# EAGLE design iswitchpihat (EAGLE 7.7.0)
CNAME: Intelligent Power Switch for Pi; CREVISION: 5; DESIGNER: Peter K. Boxler
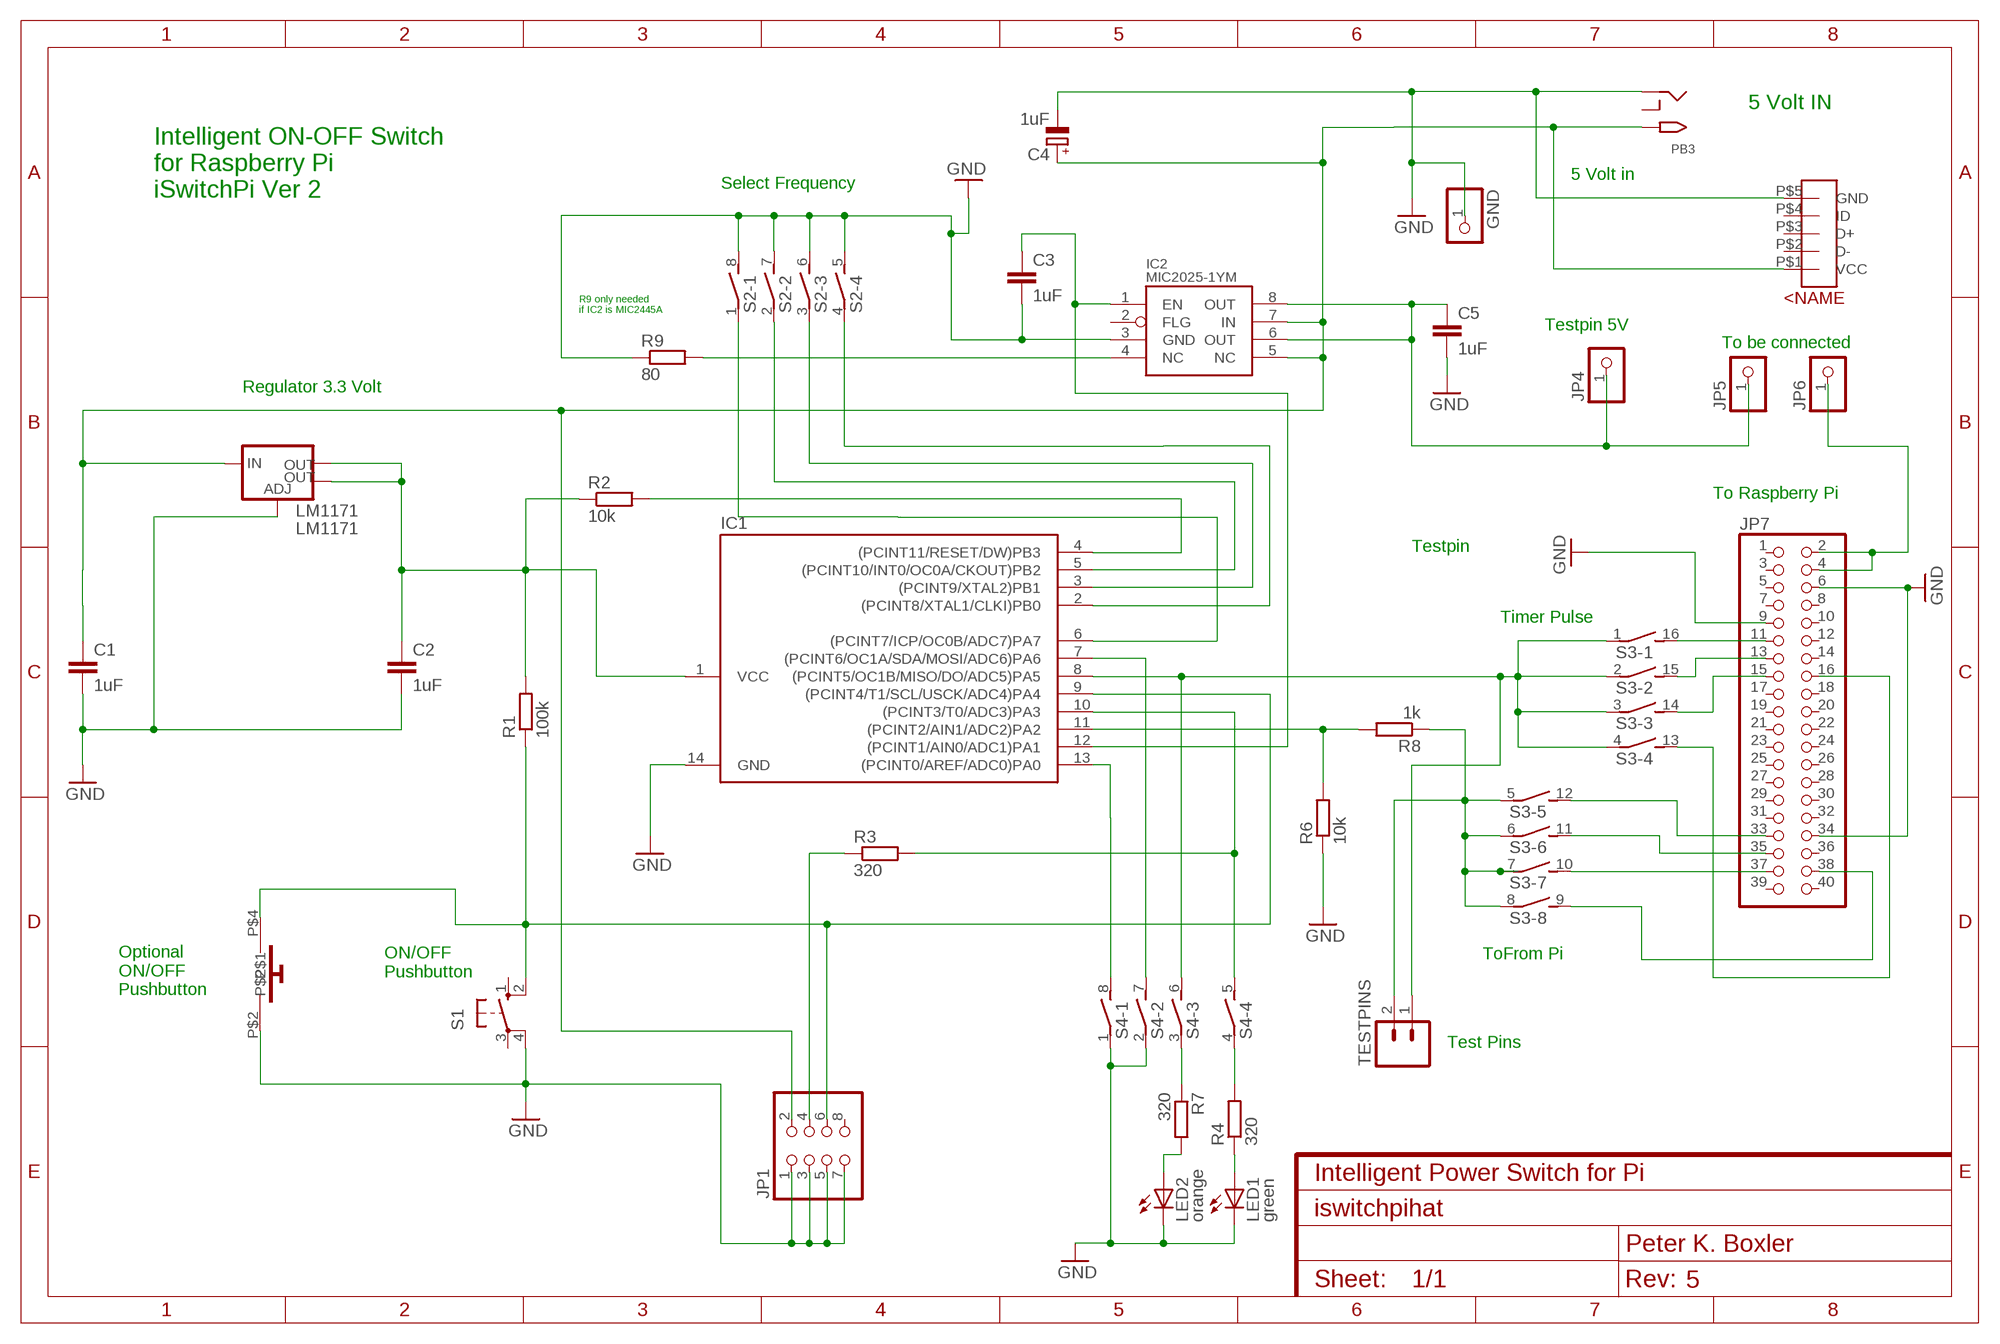
[diagram p0: schematic, sheet 1]

## Parts
C1  1uF  C-EUC1206  [C1206]
C2  1uF  C-EUC1206  [C1206]
C3  1uF  C-EUC1206  [C1206]
C4  1uF  CPOL-EUE2,5-6E  [E2,5-6E]
C5  1uF  C-EUC1206  [C1206]
GND  PINHD-1X1  [1X01]
IC1  ATTINY24/44/84-PU  [DIL14]
IC2  MIC2025-1YM  [SO08]
JP1  PINHD-2X4  [2X04]
JP4  PINHD-1X1  [1X01]
JP5  PINHD-1X1  [1X01]
JP6  PINHD-1X1  [1X01]
JP7  PINHD-2X20-BIG  [2X20-BIG]
LED1  green  LEDSMT1206  [1206]
LED2  orange  LEDSMT1206  [1206]
LM1171  LM1171  V_REG_LM1117SOT223  [SOT223]
PB1  PB6A-ELEDIS  [PA52]
PB3  2.1MMJACK  [ISWITCHPI_PJ-SMALLHOLES]
PB4  USBMICRO  ADAUSBMICRO  [ADAUSBMICRO]
R1  100k  R-EU_0204/7  [0204/7]
R2  10k  R-EU_0204/7  [0204/7]
R3  320  R-EU_0204/7  [0204/7]
R4  320  R-EU_0204/7  [0204/7]
R6  10k  R-EU_0204/7  [0204/7]
R7  320  R-EU_0204/7  [0204/7]
R8  1k  R-EU_0204/7  [0204/7]
R9  80  R-EU_0204/7  [0204/7]
S1  10-XX  [B3F-10XX]
S2  DIP04S  [DIP04S]
S3  DIP08S  [DIP08S]
S4  DIP04S  [DIP04S]
TESTPINS  M02PTH  [1X02]

## Nets
3.3V: C2.1 IC1.1(VCC) LM1171.2(OUT) LM1171.4(OUT) R1.2 R2.1
5VIN [5Volt]: C1.1 C4.+ IC2.5(NC) IC2.7(IN) JP1.2 LM1171.3(IN) PB3.TIP PB4.P$1(VCC)
5VOUT [5Volt]: C5.1 IC2.6(OUT) IC2.8(OUT) JP4.1 JP5.1
GND: C1.2 C2.2 C3.2 C4.- C5.2 GND.1 IC1.14(GND) IC2.3(GND) JP1.1 JP1.3 JP1.5 JP1.7 JP7.6 JP7.9 JP7.34 LED1.C LED2.C LM1171.1(ADJ) PB1.P$2 PB3.RING PB4.P$5(GND) R6.1 R9.1 S1.4(P1) S2.5 S2.6 S2.7 S2.8 S4.1 S4.2
N$1: IC1.9((PCINT4/T1/SCL/USCK/ADC4)PA4) JP1.6 PB1.P$4 R1.1 S1.2(S1)
N$2: IC1.6((PCINT7/ICP/OC0B/ADC7)PA7) S2.1
N$3: JP7.11 S3.16
N$4: IC1.4((PCINT11/RESET/DW)PB3) R2.2
N$6: C3.1 IC1.12((PCINT1/AIN0/ADC1)PA1) IC2.1(EN)
N$7: IC1.11((PCINT2/AIN1/ADC2)PA2) R6.2 R8.2
N$8: R8.1 S3.5 S3.6 S3.7 S3.8 TESTPINS.2
N$9: IC1.10((PCINT3/T0/ADC3)PA3) R3.2 S4.5
N$10: JP7.13 S3.15
N$11: R7.1 S4.3
N$12: LED1.A R4.1
N$13: JP1.4 R3.1
N$14: LED2.A R7.2
N$15: JP7.15 S3.14
N$16: JP7.16 S3.13
N$17: R4.2 S4.4
N$18: IC1.2((PCINT8/XTAL1/CLKI)PB0) S2.4
N$19: JP7.38 S3.9
N$20: IC1.5((PCINT10/INT0/OC0A/CKOUT)PB2) S2.2
N$21: IC1.3((PCINT9/XTAL2)PB1) S2.3
N$22 [5Volt]: JP6.1 JP7.2 JP7.4
N$23: JP7.37 S3.10
N$24: JP7.35 S3.11
N$25: JP7.33 S3.12
N$26: IC1.7((PCINT6/OC1A/SDA/MOSI/ADC6)PA6) S4.7
N$27: IC1.13((PCINT0/AREF/ADC0)PA0) S4.8
N$28: IC1.8((PCINT5/OC1B/MISO/DO/ADC5)PA5) S3.1 S3.2 S3.3 S3.4 S4.6 TESTPINS.1
N$29: IC2.4(NC) R9.2
Unconnected: IC2.2(FLG) JP1.8 JP7.1 JP7.3 JP7.5 JP7.7 JP7.8 JP7.10 JP7.12 JP7.14 JP7.17 JP7.18 JP7.19 JP7.20 JP7.21 JP7.22 JP7.23 JP7.24 JP7.25 JP7.26 JP7.27 JP7.28 JP7.29 JP7.30 JP7.31 JP7.32 JP7.36 JP7.39 JP7.40 PB3.RING_SW PB4.P$2(D-) PB4.P$3(D+) PB4.P$4(ID) S1.1(S) S1.3(P)

## Notes on the sheet
- 5 Volt IN
- 5 Volt in
- Select Frequency
- Intelligent ON-OFF Switch
  for Raspberry Pi
  iSwitchPi Ver 2
- R9 only needed 
  if IC2 is MIC2445A
- Testpin 5V
- To be connected
- Regulator 3.3 Volt
- To Raspberry Pi
- Testpin
- Timer Pulse
- ToFrom Pi
- ON/OFF 
  Pushbutton
- Optional
  ON/OFF 
  Pushbutton
- Test Pins

## Library data of the parts
C1-C3 C5 = rcl:C-EU: CAPACITOR, European symbol
C4 = resistor:CPOL-EU: POLARIZED CAPACITOR, European symbol
GND JP4-JP6 = adafruit:PINHD-1X1: Pin header 1x1 for 0.1" spacing With round pins
IC1 = attiny24_44_84:ATTINY24/44/84
IC2 = micrel:MIC2025-1Y: Single-Channel Power Distribution Switch
JP1 = adafruit:PINHD-2X4: PIN HEADER
JP7 = adafruit:PINHD-2X20: PIN HEADER
LED1 LED2 = led:LED: LED OSRAM: - CHIPLED LG R971, LG N971, LY N971, LG Q971, LY Q971, LO R971, LY R971 LH N974, LH R974 LS Q976, LO Q976, LY Q976 LO Q996 - Hyper CHIPLED LW Q18S LB Q993, LB Q99A, LB R99A - SideLED LS A670, LO A670, LY A670, LG A670, LP A670 LB A673, LV A673, LT A673, LW A673 LH A674 LY A675 LS A676, LA A676, LO A676, LY A676, LW A676 LS A679, LY A679, LG A679 - Hyper Micro SIDELED® LS Y876, LA Y876, LO Y876, LY Y876 LT Y87S - SmartLED LW L88C, LW L88S LB L89C, LB L89S, LG L890 LS L89K, LO L89K, LY L89K LS L896, LA L896, LO L896, LY L896 - TOPLED LS T670, LO T670, LY T670, LG T670, LP T670 LSG T670, LSP T670, LSY T670, LOP T670, LYG T670 LG T671, LOG T671, LSG T671 LB T673, LV T673, LT T673, LW T673 LH T674 LS T676, LA T676, LO T676, LY T676, LB T676, LH T676, LSB T676, LW T676 LB T67C, LV T67C, LT T67C, LS T67K, LO T67K, LY T67K, LW E67C LS E67B, LA E67B, LO E67B, LY E67B, LB E67C, LV E67C, LT E67C LW T67C LS T679, LY T679, LG T679 LS T770, LO T770, LY T770, LG T770, LP T770 LB T773, LV T773, LT T773, LW T773 LH T774 LS E675, LA E675, LY E675, LS T675 LS T776, LA T776, LO T776, LY T776, LB T776 LHGB T686 LT T68C, LB T68C - Hyper Mini TOPLED® LB M676 - Mini TOPLED Santana® LG M470 LS M47K, LO M47K, LY M47K Source: http://www.osram.convergy.de LUXEON: - LUMILED® LXK2-PW12-R00, LXK2-PW12-S00, LXK2-PW14-U00, LXK2-PW14-V00 LXK2-PM12-R00, LXK2-PM12-S00, LXK2-PM14-U00 LXK2-PE12-Q00, LXK2-PE12-R00, LXK2-PE12-S00, LXK2-PE14-T00, LXK2-PE14-U00 LXK2-PB12-K00, LXK2-PB12-L00, LXK2-PB12-M00, LXK2-PB14-N00, LXK2-PB14-P00, LXK2-PB14-Q00 LXK2-PR12-L00, LXK2-PR12-M00, LXK2-PR14-Q00, LXK2-PR14-R00 LXK2-PD12-Q00, LXK2-PD12-R00, LXK2-PD12-S00 LXK2-PH12-R00, LXK2-PH12-S00 LXK2-PL12-P00, LXK2-PL12-Q00, LXK2-PL12-R00 Source: www.luxeon.com KINGBRIGHT: KA-3528ASYC Source: www.kingbright.com
LM1171 = SparkFun-PowerIC:V_REG_LM1117: Voltage Regulator LM1117 Standard adjustable voltage regulator but in SMD form. Spark Fun Electronics SKU : COM-00595; PROD_ID: VREG-08170
PB1 = a-mylibrary:PB6A-ELEDIS: PushButton Eledis (Distrelec) für iswitcjPihat
PB3 = iswitchpihat:2.1MMJACK: 2.1mm x 5.5mm THM DC jack with internal switch. Digikey part #PJ-102A, 4UCON part #05537 2.1mm x 5.5mm SMT DC jack with internal switch. Digikey part #PJ-002A-SMT, 4UCON part #03267 By microbuilder.eu & adafruit.com
PB4 = a-mylibrary:ADAUSBMICRO
R1-R4 R6-R9 = resistor:R-EU_: RESISTOR, European symbol
S1 = switch-omron:10-XX: OMRON SWITCH; MPN: B3F-1000; OC_FARNELL: 176432; OC_NEWARK: 36M3542
S2 S4 = switch-dil:DIP04S: DIL/CODE SWITCH
S3 = switch-dil:DIP08S: DIL/CODE SWITCH
TESTPINS = SparkFun-Connectors:M02: Standard 2-pin 0.1" header. Use with - straight break away headers ( PRT-00116) - right angle break away headers (PRT-00553) - swiss pins (PRT-00743) - machine pins (PRT-00117) - female headers (PRT-00115) Molex polarized connector foot print use with: PRT-08233 with associated crimp pins and housings. 2.54_SCREWTERM for use with PRT-10571. 3.5mm Screw Terminal footprints for PRT-08084 5mm Screw Terminal footprints for use with PRT-08432

## Net classes
1 5Volt: width 1.016 mm

## Board
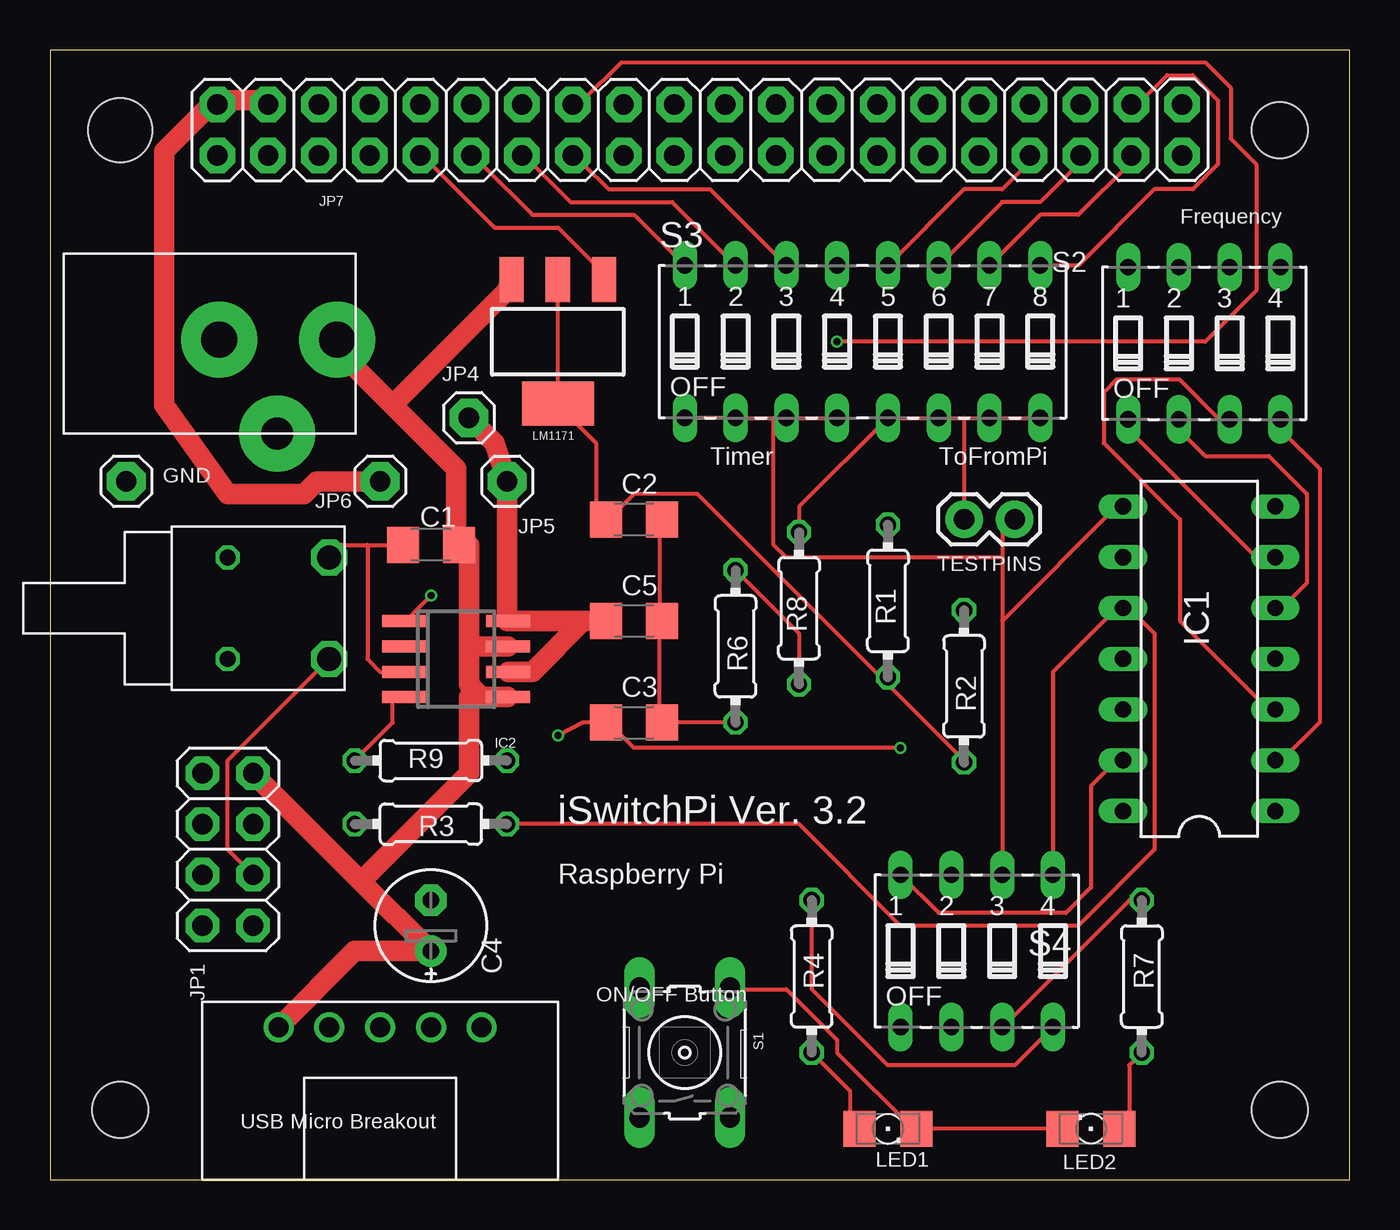
[diagram p1: board, top side]
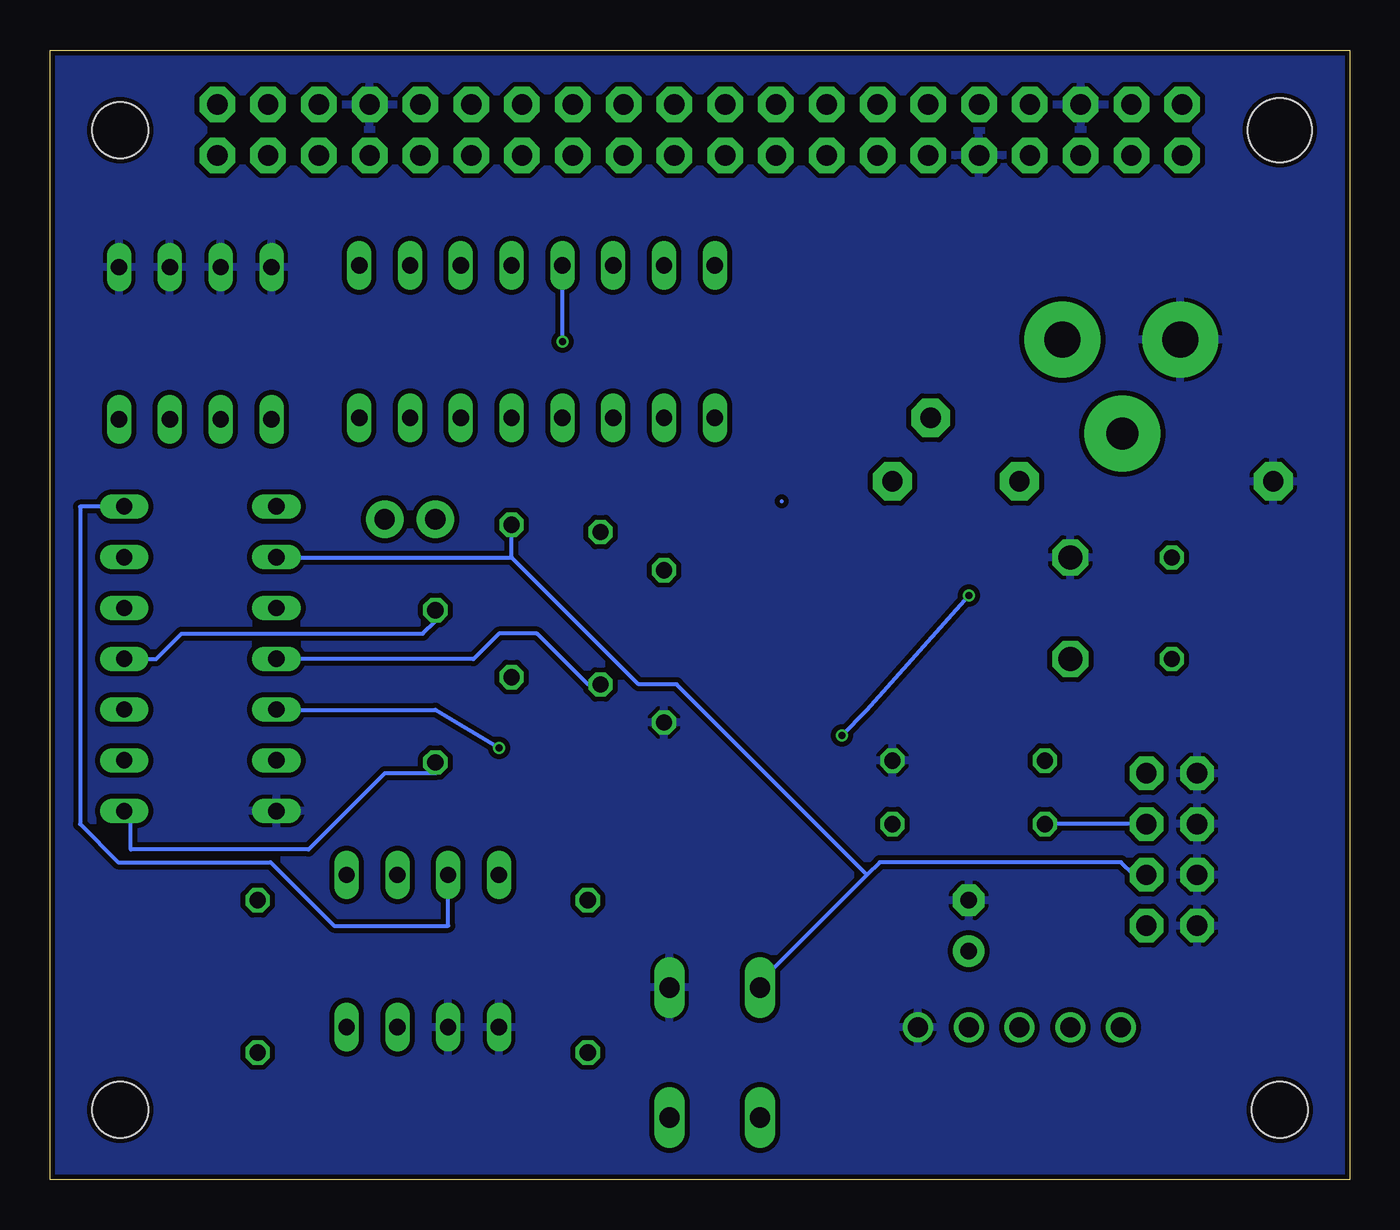
[diagram p2: board, bottom side, seen from below]

Size 65 x 56.5 mm. Coordinates in mm from the lower left corner, seen from the top.
Outline: 0,0 65,0 65,56.5 0,56.5 0,0
Copper layers (1*16): Top 0.035mm / dielectric 1.55mm / Bottom 0.035mm
Design rules "eC_2Layer_PClass6_BaseCopperO35 *": minimum track width 0.2mm, minimum drill 0.35mm, track to track 0.25mm, track to pad 0.25mm, pad to pad 0.25mm, via to via 0.25mm, smd to smd 0mil, copper to edge 0.25mm, drill to drill 0.35mm, minimum pad ring 0.175mm, minimum via ring 0.125mm, stop-mask expansion 0mil, vias tented up to drill 0.45mm, thermal gap 0.2mm
Holes 3.2 mm at 3.5,52.5
Holes 2.8 mm at 61.5,52.5 61.5,3.5 3.5,3.5

### Footprints (pad centres in the part's own frame; a part is rotated, then mirrored left to right if it is on the bottom)
C1206 = smd 1.6 x 1.8: 1 -1.4,0; 2 1.4,0
E2,5-6E = drill 0.813 pad 1.575: + -1.27,0 | drill 0.813 pad 1.575 octagon: - 1.27,0
1X01 = drill 1.016 pad 1.93 octagon: 1 0,0
DIL14 = drill 0.813 long: 1 -7.62,-3.81; 2 -5.08,-3.81; 3 -2.54,-3.81; 4 0,-3.81; 5 2.54,-3.81; 6 5.08,-3.81; 7 7.62,-3.81; 8 7.62,3.81; 9 5.08,3.81; 10 2.54,3.81; 11 0,3.81; 12 -2.54,3.81; 13 -5.08,3.81; 14 -7.62,3.81
SO08 = smd 0.6 x 2.2: 1 -1.905,-2.6; 2 -0.635,-2.6; 3 0.635,-2.6; 4 1.905,-2.6; 5 1.905,2.6; 6 0.635,2.6; 7 -0.635,2.6; 8 -1.905,2.6
2X04 = drill 1.016 pad 1.676 octagon: 1 -3.81,-1.27; 2 -3.81,1.27; 3 -1.27,-1.27; 4 -1.27,1.27; 5 1.27,-1.27; 6 1.27,1.27; 7 3.81,-1.27; 8 3.81,1.27
2X20-BIG = drill 1.016 pad 1.778 octagon: 1 -24.13,-1.27; 2 -24.13,1.27; 3 -21.59,-1.27; 4 -21.59,1.27; 5 -19.05,-1.27; 6 -19.05,1.27; 7 -16.51,-1.27; 8 -16.51,1.27; 9 -13.97,-1.27; 10 -13.97,1.27; 11 -11.43,-1.27; 12 -11.43,1.27; 13 -8.89,-1.27; 14 -8.89,1.27; 15 -6.35,-1.27; 16 -6.35,1.27; 17 -3.81,-1.27; 18 -3.81,1.27; 19 -1.27,-1.27; 20 -1.27,1.27; 21 1.27,-1.27; 22 1.27,1.27; 23 3.81,-1.27; 24 3.81,1.27; 25 6.35,-1.27; 26 6.35,1.27; 27 8.89,-1.27; 28 8.89,1.27; 29 11.43,-1.27; 30 11.43,1.27; 31 13.97,-1.27; 32 13.97,1.27; 33 16.51,-1.27; 34 16.51,1.27; 35 19.05,-1.27; 36 19.05,1.27; 37 21.59,-1.27; 38 21.59,1.27; 39 24.13,-1.27; 40 24.13,1.27
1206 = smd 1.6 x 1.803: A -1.422,0; C 1.422,0
SOT223 = smd 1.219 x 2.235: 1 -2.311,-3.099; 2 0,-3.099; 3 2.311,-3.099 | smd 3.6 x 2.2: 4 0,3.099
PA52 = drill 0.8 octagon: P$1 -2.54,1.27; P$3 -2.54,-3.81 | drill 1.2 octagon: P$2 2.54,1.27; P$4 2.54,-3.81
ISWITCHPI_PJ-SMALLHOLES = drill 1.8 pad 3.8: RING 0.1,-3.39; TIP 0.1,-9.29 | drill 1.6 pad 3.8: RING_SW -4.6,-6.29
ADAUSBMICRO = drill 1: P$1 -6.35,2.54; P$2 -3.81,2.54; P$3 -1.27,2.54; P$4 1.27,2.54; P$5 3.81,2.54
0204/7 = drill 0.813 octagon: 1 -3.81,0; 2 3.81,0
B3F-10XX = drill 1.016 long: 1 -3.251,2.261; 2 3.251,2.261; 3 -3.251,-2.261; 4 3.251,-2.261
DIP04S = drill 0.813 long: 1 -3.81,-3.81; 2 -1.27,-3.81; 3 1.27,-3.81; 4 3.81,-3.81; 5 3.81,3.81; 6 1.27,3.81; 7 -1.27,3.81; 8 -3.81,3.81
DIP08S = drill 0.813 long: 1 -8.89,-3.81; 2 -6.35,-3.81; 3 -3.81,-3.81; 4 -1.27,-3.81; 5 1.27,-3.81; 6 3.81,-3.81; 7 6.35,-3.81; 8 8.89,-3.81; 9 8.89,3.81; 10 6.35,3.81; 11 3.81,3.81; 12 1.27,3.81; 13 -1.27,3.81; 14 -3.81,3.81; 15 -6.35,3.81; 16 -8.89,3.81
1X02 = drill 1.016 pad 1.88: 1 0,0; 2 2.54,0

### Placement (x,y rotation side)
C1  19.05,31.75 180 top
C2  29.21,33.02 0 top
C3  29.21,22.86 0 top
C4  19.05,12.7 90 top
C5  29.21,27.94 0 top
GND  3.81,34.92 0 top
IC1  57.48,26.05 90 top
IC2  20.32,26.04 270 top
JP1  8.89,16.51 270 top
JP4  20.95,38.1 0 top
JP5  22.86,34.92 0 top
JP6  16.51,34.92 0 top
JP7  32.5,52.5 0 top
LED1  41.91,2.54 0 top
LED2  52.07,2.54 180 top
LM1171  25.4,41.91 180 top
PB1  11.43,29.84 0 top
PB3  5.08,41.91 90 top
PB4  17.78,5.08 0 top
R1  41.91,28.94 270 top
R2  45.72,24.67 90 top
R3  19.05,17.78 0 top
R4  38.1,10.16 90 top
R6  34.29,26.67 90 top
R7  54.61,10.16 270 top
R8  37.47,28.57 270 top
R9  19.05,20.95 180 top
S1  31.75,6.35 90 top
S2  57.73,41.83 0 top
S3  40.64,41.91 0 top
S4  46.35,11.43 0 top
TESTPINS  48.26,33.02 180 top

### Tracks (layer width: path | path; a pad name or v marks a point on that pad's centre or on a via)
3.3V
  Top 0.2: LM1171.2 25.4,44.45 25.4,39.37 LM1171.4 25.4,38.73 27.3,36.83 27.3,33.02 C2.1 27.94,33.02 29.21,34.29 32.38,34.29 41.91,24.77 | 41.91,24.77 45.72,20.95 R2.1 | 41.91,24.77 R1.2 41.91,24.77
  Bottom 0.2: IC1.1 60.96,18.41 60.96,16.51 52.07,16.51 48.26,20.32 45.72,20.32 R2.1
5VIN
  Top 1.016: PB4.P$1 15.24,11.43 C4.+ 15.56,14.92 | 15.56,14.92 JP1.2 | 17.14,38.73 13.97,41.91 PB3.TIP | 17.14,38.73 20.32,35.56 20.32,31.75 C1.1 20.95,31.75 20.95,26.67 | 21.27,24.45 20.95,24.77 20.95,26.67 | 21.27,24.45 21.59,24.13 22.86,24.13 IC2.5 | 20.95,26.67 22.86,26.67 IC2.7 | 17.14,38.73 22.86,44.45 LM1171.3 | 15.56,14.92 15.88,15.24 20.95,20.32 20.95,24.13 21.27,24.45
5VOUT
  Top 1.016: 26.67,27.94 23.5,27.94 IC2.8 22.86,27.94 JP5.1 22.23,36.83 JP4.1 | 26.67,27.94 27.3,27.94 C5.1 | 26.67,27.94 24.13,25.4 23.5,25.4 IC2.6
GND
  Top 0.2: LED2.C 50.16,2.54 43.81,2.54 LED1.C 43.18,2.54 39.37,6.35 39.37,6.99 36.83,9.53 34.29,9.53 S1.4 | 30.48,27.94 30.48,33.02 C2.2 | 30.48,27.94 C5.2 30.48,27.94 | 15.88,31.75 14.61,31.75 PB1.P$2 | 15.88,31.75 17.14,31.75 C1.2 | R6.1 31.11,22.86 C3.2 30.48,22.86 30.48,27.94 | 15.88,31.75 15.88,26.04 16.51,25.4 17.14,25.4 IC2.3 | LM1171.1 27.3,45.09 27.3,45.72 25.4,47.62 22.23,47.62 19.05,50.8 JP7.9
  pour Bottom: 0,57.15 66.04,57.15 66.04,-1.27 -1.27,-1.27 -1.27,57.15
N$1
  Top 0.2: PB1.P$4 8.89,20.95 8.89,16.51 JP1.6
  Bottom 0.2: 41.91,31.11 41.91,32.38 R1.1 | 41.91,31.11 53.34,31.11 IC1.9 | 24.13,15.24 23.5,15.88 11.43,15.88 10.79,15.24 JP1.6 | 24.13,15.24 29.21,10.16 S1.2 | 41.91,31.11 35.56,24.77 33.66,24.77 24.13,15.24
N$2
  Top 0.2: S2.1 53.98,37.47 60.33,31.11 60.96,31.11 IC1.6
N$3
  Top 0.2: S3.16 29.21,48.26 24.13,48.26 21.59,50.8 JP7.11
N$4
  Bottom 0.2: R2.2 45.72,27.94 46.35,27.3 58.42,27.3 59.69,26.04 60.96,26.04 IC1.4
N$5
  Bottom 0.2: 28.41,33.94 28.41,33.93 28.41,33.94
N$6  (via drill 0.35)
  Top 0.2: v42.55,21.59 29.21,21.59 27.94,22.86 C3.1 27.3,22.86 26.67,22.86 v25.4,22.23 | v19.05,29.21 17.78,27.94 IC2.1
  Bottom 0.2: v42.55,21.59 45.72,23.5 53.34,23.5 IC1.12 | v19.05,29.21 24.13,23.5 v25.4,22.23
N$7
  Top 0.2: R8.2 37.47,27.3 R6.2
  Bottom 0.2: R8.2 38.1,24.77 40.64,27.3 42.55,27.3 43.81,26.04 53.34,26.04 IC1.11
N$8
  Top 0.2: R8.1 37.47,33.66 S3.5 S3.6 45.72,38.1 | 45.72,38.1 S3.7 S3.8 | 45.72,38.1 TESTPINS.2
N$9
  Top 0.2: R3.2 37.47,17.78 42.55,12.7 51.44,12.7 55.24,16.51 55.24,27.3 53.98,28.57 IC1.10 53.34,28.57 50.16,25.4 S4.5
N$10
  Top 0.2: S3.15 31.11,48.9 26.04,48.9 24.13,50.8 JP7.13
N$11
  Top 0.2: S4.3 53.98,13.97 R7.1
N$12
  Top 0.2: R4.1 40.01,4.45 40.01,2.54 LED1.A
N$13
  Bottom 0.2: JP1.4 R3.1
N$14
  Top 0.2: R7.2 53.98,5.71 53.98,2.54 LED2.A
N$15
  Top 0.2: S3.14 33.02,49.53 27.94,49.53 26.67,50.8 JP7.15
N$16  (via drill 0.35)
  Top 0.2: v39.37,41.91 57.78,41.91 60.33,44.45 60.33,50.8 59.05,52.07 59.05,54.61 57.78,55.88 28.57,55.88 26.67,53.98 JP7.16
  Bottom 0.2: v39.37,41.91 S3.13
N$17
  Top 0.2: R4.2 38.1,9.53 41.91,5.71 48.26,5.71 S4.4
N$18
  Top 0.2: IC1.2 61.59,20.95 63.5,22.86 63.5,35.56 61.59,37.47 S2.4
N$19
  Top 0.2: S3.9 51.44,45.72 55.24,49.53 57.15,49.53 58.42,50.8 58.42,53.98 57.15,55.24 55.88,55.24 54.61,53.98 JP7.38
N$20
  Top 0.2: IC1.5 61.59,28.57 62.87,29.84 62.87,34.29 60.96,36.2 57.78,36.2 56.52,37.47 S2.2
N$21
  Top 0.2: IC1.3 60.96,23.5 56.52,27.94 56.52,33.02 52.7,36.83 52.7,39.37 53.34,40.01 56.52,40.01 58.42,38.1 S2.3
N$22
  Top 1.016: JP7.4 10.79,53.98 8.89,53.98 JP7.2 8.26,53.98 5.71,51.44 5.71,38.73 8.89,34.29 12.7,34.29 13.34,34.92 JP6.1
N$23
  Top 0.2: S3.10 49.53,48.26 51.44,48.26 53.98,50.8 JP7.37
N$24
  Top 0.2: S3.11 47.62,48.9 49.53,48.9 51.44,50.8 JP7.35
N$25
  Top 0.2: S3.12 45.72,49.53 47.62,49.53 48.9,50.8 JP7.33
N$26
  Bottom 0.2: S4.7 45.09,12.7 50.8,12.7 53.98,15.88 61.59,15.88 63.5,17.78 63.5,33.66 61.59,33.66 IC1.7
N$27
  Top 0.2: S4.8 44.45,13.34 50.8,13.34 52.07,14.61 52.07,19.68 53.34,20.95 IC1.13
N$28
  Top 0.2: S3.1 S3.2 36.2,38.1 | 36.2,38.1 S3.3 S3.4 | 47.62,31.11 47.62,32.38 TESTPINS.1 | 47.62,31.11 47.62,27.94 | 47.62,27.94 S4.6 | 47.62,27.94 53.34,33.66 IC1.8 | 36.2,38.1 36.2,31.75 36.83,31.11 47.62,31.11
N$29
  Top 0.2: R9.2 17.14,22.86 17.14,24.13 IC2.4

### Text on the board
tPlace: Frequency | Timer | ToFromPi | iSwitchPi Ver. 3.2 | Raspberry Pi | ON/OFF Button | USB Micro Breakout